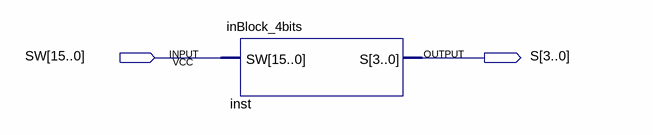
[diagram p0: schematic sheet]
// Quartus schematic Entrada.bdf as structural Verilog: 1 symbols, 2 pins
module Entrada (
  input  [15:0] SW,
  output [3:0] S
);

  inBlock_4bits inst (.SW(SW), .S(S));
endmodule
